# EAGLE design Adafruit STEMMA Piezo Driver Amp (EAGLE 9.6.2)
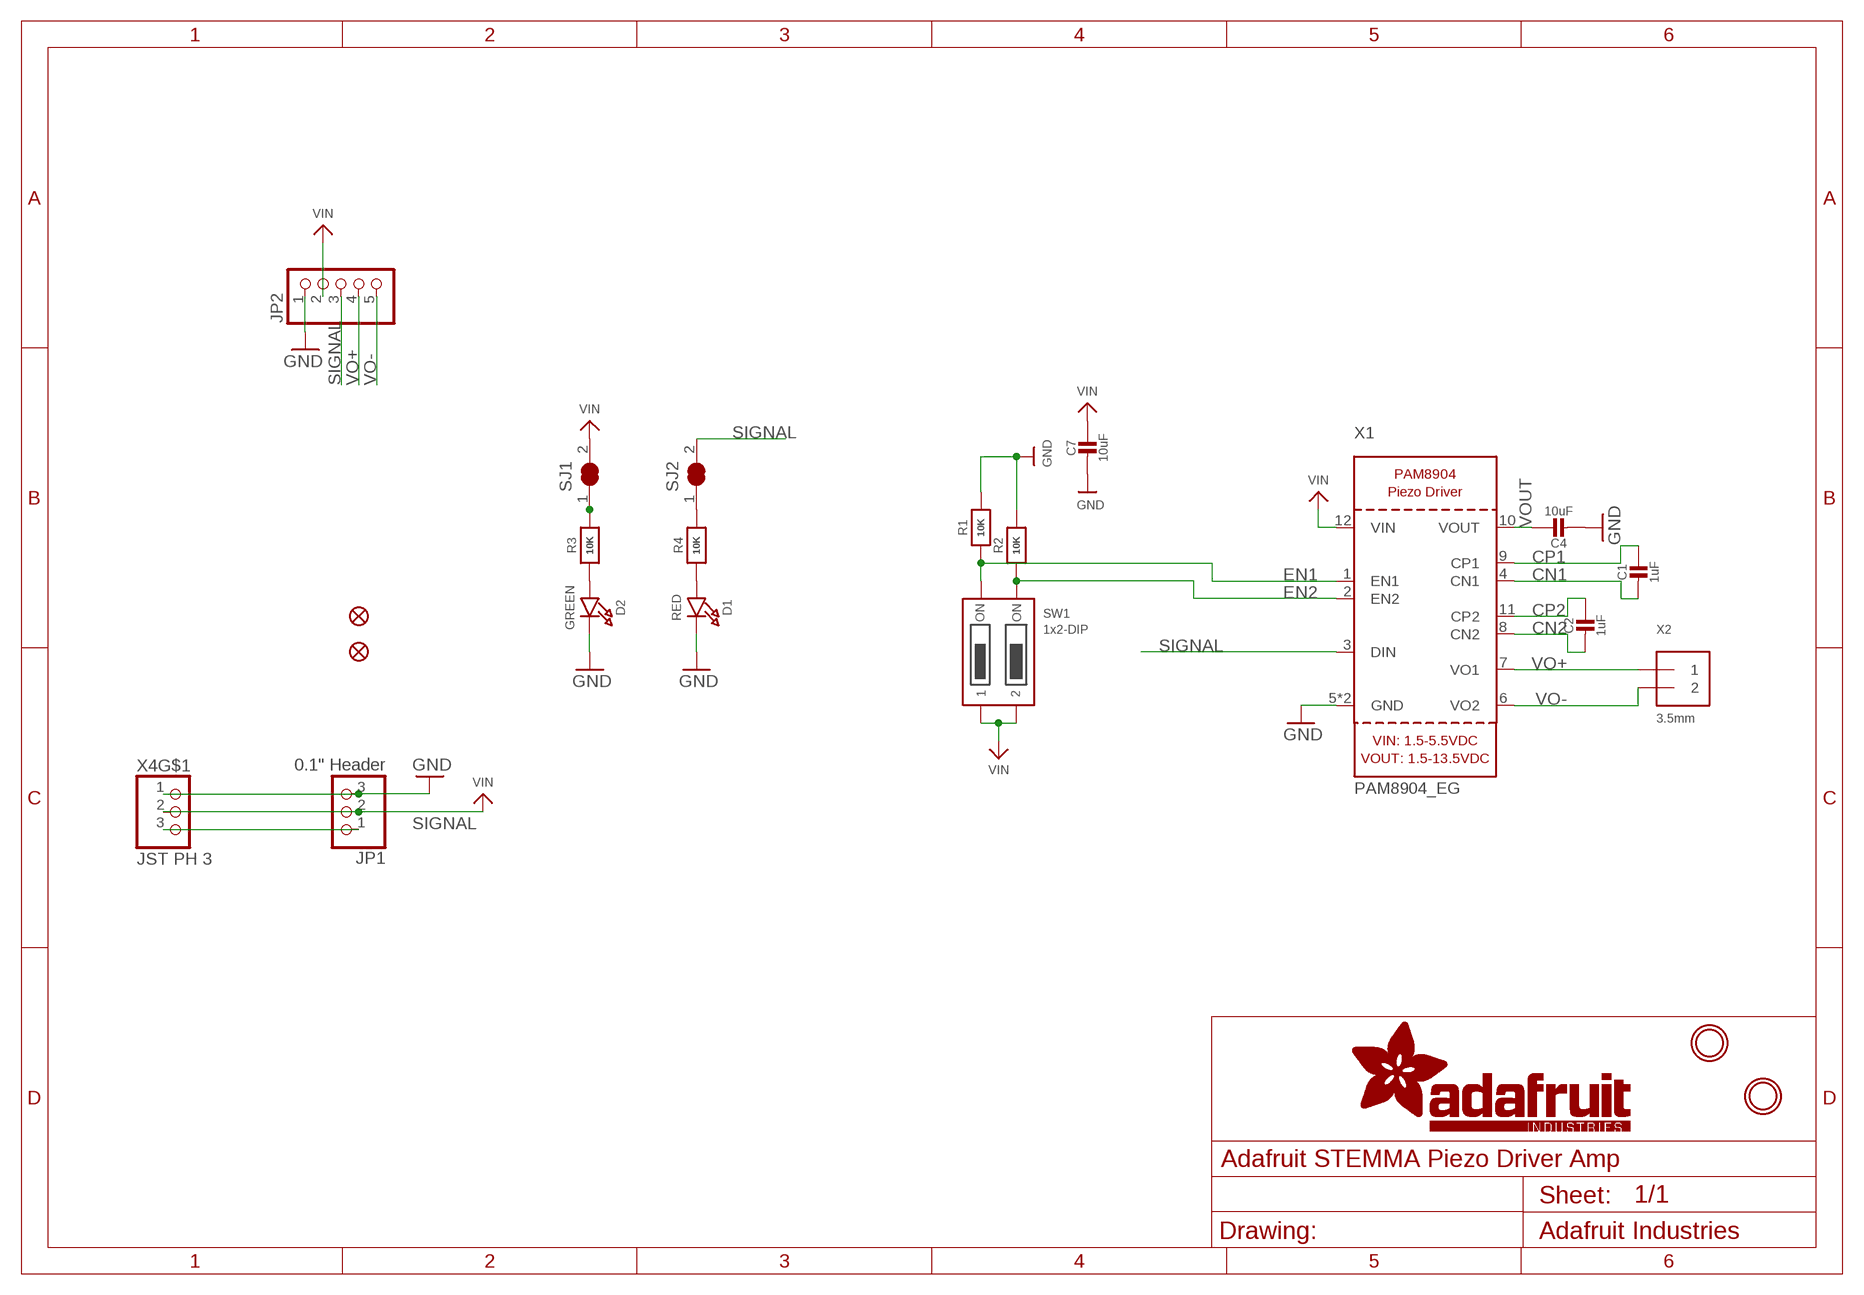
[diagram p0: schematic, sheet 1]

## Parts
C1  1uF  CAP_CERAMIC0603_NO  [0603-NO]
C2  1uF  CAP_CERAMIC0603_NO  [0603-NO]
C4  10uF  CAP_CERAMIC0805-NOOUTLINE  [0805-NO]
C7  10uF  CAP_CERAMIC0805-NOOUTLINE  [0805-NO]
D1  RED  LED0603_NOOUTLINE  [CHIPLED_0603_NOOUTLINE]
D2  GREEN  LED0603_NOOUTLINE  [CHIPLED_0603_NOOUTLINE]
FID2  FIDUCIAL_1MM  [FIDUCIAL_1MM]
FID3  FIDUCIAL_1MM  [FIDUCIAL_1MM]
JP1  0.1" Header  HEADER-1X3  [1X03_OVAL]
JP2  HEADER-1X570MIL  [1X05_ROUND_70]
R1  10K  RESISTOR_0603_NOOUT  [0603-NO]
R2  10K  RESISTOR_0603_NOOUT  [0603-NO]
R3  10K  RESISTOR_0603_NOOUT  [0603-NO]
R4  10K  RESISTOR_0603_NOOUT  [0603-NO]
SJ1  SOLDERJUMPER_CLOSED  [SOLDERJUMPER_CLOSEDWIRE]
SJ2  SOLDERJUMPER_CLOSED  [SOLDERJUMPER_CLOSEDWIRE]
SW1  1x2-DIP  DIPSWITCH_2PIN  [DIPSWITCH_2PIN]
U$1  MOUNTINGHOLE2.5  [MOUNTINGHOLE_2.5_PLATED]
U$8  MOUNTINGHOLE2.5  [MOUNTINGHOLE_2.5_PLATED]
X1  PAM8904_EG  [QFN12-2MM]
X2  3.5mm  TERMBLOCK_1X2_3.5MM  [TERMBLOCK_1X2-3.5MM]
X4  JST PH 3  CON_JST_PH_3PIN  [JSTPH3]

## Nets
CN1: C1.2 X1.4(CN1)
CN2: C2.2 X1.8(CN2)
CP1: C1.1 X1.9(CP1)
CP2: C2.1 X1.11(CP2)
EN1: R1.1 SW1.1ON X1.1(EN1)
EN2: R2.1 SW1.2ON X1.2(EN2)
GND: C4.2 C7.2 D1.C D2.C JP1.3 JP2.1 R1.2 R2.2 X1.5(GND) X1.MT(GND) X4.1
N$1: R3.2 SJ1.1
N$9: D1.A R4.1
N$10: R4.2 SJ2.1
N$26: D2.A R3.1
SIGNAL: JP1.1 JP2.3 SJ2.2 X1.3(DIN) X4.3
VIN: C7.1 JP1.2 JP2.2 SJ1.2 SW1.1OFF SW1.2OFF X1.12(VIN) X4.2
VO+: JP2.4 X1.7(VO1) X2.1
VO-: JP2.5 X1.6(VO2) X2.2
VOUT: C4.1 X1.10(VOUT)
Unconnected: X4.NC1(MT) X4.NC2(MT)

## Library data of the parts
C1 C2 C4 C7 = microbuilder:CAP_CERAMIC: Ceramic Capacitors For new designs, use the packages preceded by an '_' character since they are more reliable: The following footprints should be used on most boards: _0402 - Standard footprint for regular board layouts _0603 - Standard footprint for regular board layouts _0805 - Standard footprint for regular board layouts _1206 - Standard footprint for regular board layouts For extremely tight-pitch boards where space is at a premium, the following 'micro-pitch' footprints can be used (smaller pads, no silkscreen outline, etc.): _0402MP - Micro-pitch footprint for very dense/compact boards _0603MP - Micro-pitch footprint for very dense/compact boards _0805MP - Micro-pitch footprint for very dense/compact boards _1206MP - Micro-pitch footprint for very dense/compact boards
D1 D2 = microbuilder:LED: LED 0603 - 0603 Surface Mount Package 2mA: Green LED - Low Power (3.9mcd, 2ma, 1.7Vf) - Digikey: 475-2709-2-ND Orange LED - Low Power (9.8mcd, 2ma, 1.8Vf) - Digikey: 475-1194-2-ND Red LED - Low Power (5mcd, 2ma, 1.8Vf) - Digikey: 475-1195-2-ND Yellow LED - Low Power (7mcd, 2ma, 1.8Vf) - Digikey: 475-1196-2-ND 5mA: Blue LED - Low Power (17mcd, 5ma, 2.9Vf) - Digikey: LNJ937W8CRACT-ND 0805 - 0805 Surface Mount Package 2mA: Red LED (8.8mcd, 2mA, 1.8Vf, Clear) - Low Power [Digikey: 475-2510-1-ND] Green LED (5mcd, 2mA, 1.8Vf, Clear) - Low Power [Digikey: 475-2730-1-ND] Yellow LED (11.3mcd, 2mA, 1.8Vf, Clear) - Low Power [Digikey: 475-2555-1-ND] 20mA: Red LED (104mcd, 20mA, Diffused) - LS R976 [Digikey: 475-1278-6-ND] Red LED (12mcd, 20mA, 2.0Vf, Clear) - APT2012EC [Digikey: 754-1128-1-ND] Green LED (15mcd, 20mA, 2.2Vf, Clear) - APT2012GC [Digikey: 754-1131-1-ND] Orange LED (160mcd, 20mA, 2.1Vf, Clear) - APT2012SECK [Digikey: 754-1130-1-ND] 1206 - 1206 Surface Mount Package Green LED (26mcd, 20mA, Diffused) - LG N971 [Digikey: 475-1407-6-ND] Red LED (15mcd, 20mA, Diffused) - LH N974 [Digikey: 475-1416-6-ND] Cree - Cree High-Power Surface Mount LEDs XPEBWT-L1-0000-00D50 - White 111lm 350mA 2.9Vf 6200K 110° XTEAWT-00-0000-00000LEE3 - White 114lm 350mA 2.85Vf 5000K 115° Everlight - Everlight 45-21 Series Surface Mount LEDs 45-21/QK2C-B2832AC2CB2/2T - Warm White 2000mcd 20mA 3.25Vf 3050K 120° 45-21/LK2C-B38452C4CB2/2T - Nuetral White 2000mcd 20mA 3.25Vf 4150K 120° 45-21/LK2C-B50634C6CB2/2T - Cold White 2200mcd 20mA 3.25Vf 5650K 120° PLCC2 Reverse Mount LS T77K-J1L2-1-0-2-R18-Z - Red 11.25mcd 2mA 1.8Vf 630nm 120° LO T77K-L1M2-24-Z - Orange 19.6mcd 2mA 1.8Vf 606nm 120° LY T77K-K2M1-26-Z - Yellow 15.7mcd 2mA 1.8Vf 587nm 120°; ROT: 270
FID2 FID3 = microbuilder:FIDUCIAL: Fiducial Alignment Points Various fiducial points for machine vision alignment.; BOM: EXCLUDE
JP1 = microbuilder:HEADER-1X3: PIN HEADER
JP2 = microbuilder:HEADER-1X5: PIN HEADER
R1-R4 = microbuilder:RESISTOR: Resistors For new designs, use the packages preceded by an '_' character since they are more reliable: The following footprints should be used on most boards: _0402 - Standard footprint for regular board layouts _0603 - Standard footprint for regular board layouts _0805 - Standard footprint for regular board layouts _1206 - Standard footprint for regular board layouts For extremely tight-pitch boards where space is at a premium, the following 'micro-pitch' footprints can be used (smaller pads, no silkscreen outline, etc.): _0402MP - Micro-pitch footprint for very dense/compact boards _0603MP - Micro-pitch footprint for very dense/compact boards _0805MP - Micro-pitch footprint for very dense/compact boards _1206MP - Micro-pitch footprint for very dense/compact boards
SJ1 SJ2 = microbuilder:SOLDERJUMPER_CLOSED: Solder Jumper - Closed These solder jumpers are closed by default CLOSEDWIRE - 10 mil trace between pads that can be cut and resoldered later CLOSEDPERM - 63 mil trace between pads for a permanent connection (used to 'bridge' two signals, a shameless hack for Eagle). Can double as a test point as well (no cream layer)
SW1 = adafruit_electromech:DIPSWITCH_2PIN: DIP Switch - 2 Pin - [4UConnector: 19493]
U$1 U$8 = adafruit_electromech:MOUNTINGHOLE: Mounting Hole For #2 screws (0.086"/2.18mm width, 0.094"/2.4mm hole) use 2.5mm; BOM: EXCLUDE
X1 = adafruit_power:PAM8904
X2 = adafruit_electromech:TERMBLOCK_1X2: 3.5mm Terminal block http://www.ladyada.net/library/pcb/eaglelibrary.html; ROT: 180
X4 = adafruit_electromech:CON_JST_PH_3PIN

## Net classes
1 HV: width 0.406 mm, drill 0.381 mm, clearance 0.762 mm

## Board
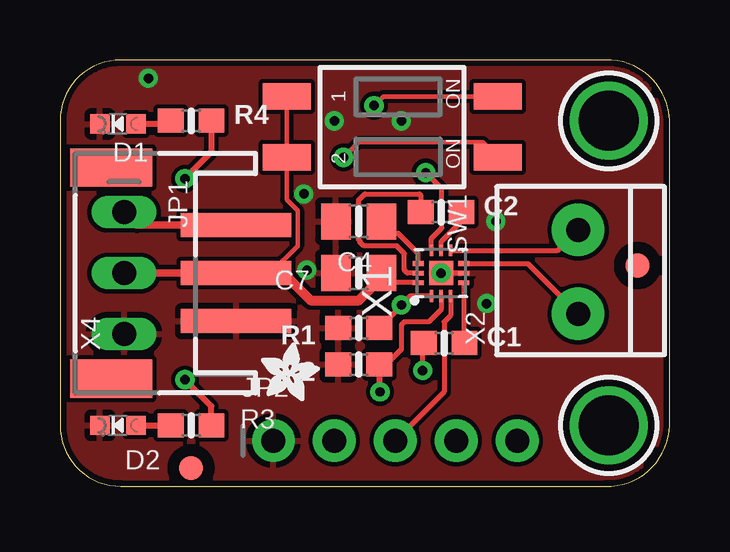
[diagram p1: board, top side]
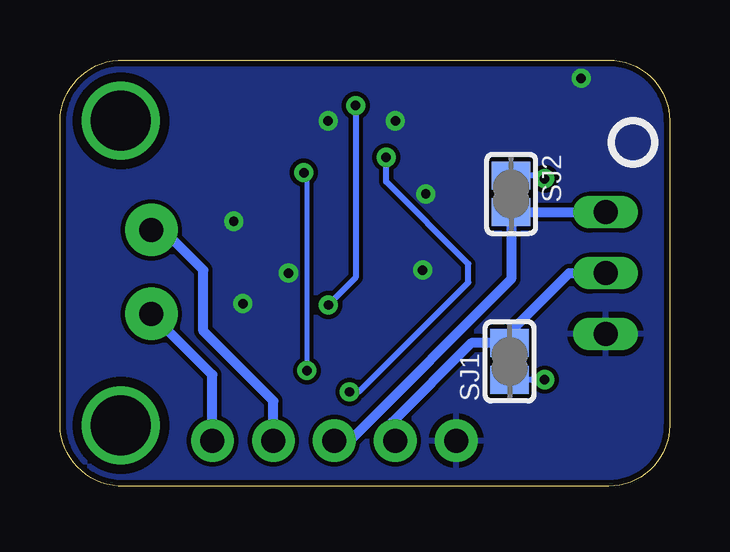
[diagram p2: board, bottom side, seen from below]

Size 25.4 x 17.78 mm. Coordinates in mm from the lower left corner, seen from the top.
Outline: 0,15.24 0,2.54 arc90 2.54,0 22.73,0 arc90 25.4,2.54 25.4,15.24 arc90 22.73,17.78 2.54,17.78 arc90 0,15.24
Copper layers (1*16): Top 0.035mm / dielectric 1.5mm / Bottom 0.035mm
Design rules "adafruit 7-7": minimum track width 7mil, minimum drill 15.5mil, track to track 7mil, track to pad 7mil, pad to pad 7mil, via to via 7mil, smd to smd 7mil, copper to edge 10mil, drill to drill 8mil, minimum pad ring 7mil, minimum via ring 8mil, stop-mask expansion 2mil, vias tented up to drill 20mil, thermal gap 10mil

### Footprints (pad centres in the part's own frame; a part is rotated, then mirrored left to right if it is on the bottom)
0603-NO = smd 1.075 x 1: 1 -0.85,0; 2 0.85,0
0805-NO = smd 1.24 x 1.5: 1 -0.95,0; 2 0.95,0
CHIPLED_0603_NOOUTLINE = smd 0.8 x 0.8: A 0,-0.75; C 0,0.75
FIDUCIAL_1MM = smd 1 x 1: 1 0,0
1X03_OVAL = drill 1 long: 1 -2.54,0; 2 0,0; 3 2.54,0
1X05_ROUND_70 = drill 1 pad 1.778: 1 -5.08,0; 2 -2.54,0; 3 0,0; 4 2.54,0; 5 5.08,0
SOLDERJUMPER_CLOSEDWIRE = smd 1.168 x 1.6: 1 -0.762,0; 2 0.762,0 | smd 0.635 x 0.203: WIRE 0,0
DIPSWITCH_2PIN = smd 1.1 x 2: 1OFF -1.27,-4.4; 1ON -1.27,4.4; 2OFF 1.27,-4.4; 2ON 1.27,4.4
MOUNTINGHOLE_2.5_PLATED = drill 2.5 pad 3.2: P$1 0,0
QFN12-2MM = smd 0.5 x 0.2: 1 -0.95,0.4; 2 -0.95,0; 3 -0.95,-0.4; 7 0.95,-0.4; 8 0.95,0; 9 0.95,0.4 | smd 0.2 x 0.5: 4 -0.4,-0.95; 5 0,-0.95; 6 0.4,-0.95; 10 0.4,0.95; 11 0,0.95; 12 -0.4,0.95 | smd 1 x 1: MT 0,0
TERMBLOCK_1X2-3.5MM = drill 1 pad 2.184: 1 1.8,0; 2 -1.7,0
JSTPH3 = smd 1 x 4.6: 1 -2,-2.7; 2 0,-2.7; 3 2,-2.7 | smd 1.6 x 3.4: NC1 -4.4,2.5; NC2 4.4,2.5

### Placement (x,y rotation side)
C1  16,5.97 0 top
C2  15.88,11.43 0 top
C4  12.45,11.05 180 top
C7  12.45,8.89 180 top
D1  2.41,15.11 90 top
D2  2.41,2.54 90 top
FID2  5.46,0.76 0 top
FID3  24.07,9.21 0 top
JP1  2.67,8.89 270 top
JP2  13.97,1.91 0 top
PLABEL0  [PLABEL0]  1.4,0.76 0 top
PLABEL7  [PLABEL7]  8.89,3.05 90 bottom
PLABEL8  [PLABEL8]  11.43,3.05 90 bottom
PLABEL10  [PLABEL10]  16.51,3.05 90 bottom
PLABEL11  [PLABEL11]  19.05,3.05 90 bottom
PLABEL12  [PLABEL12]  7.75,2.79 0 bottom
PLABEL13  [PLABEL13]  1.27,16 0 top
PLABEL14  [PLABEL14]  20.57,13.08 90 top
PLABEL15  [PLABEL15]  20.57,15.62 90 top
PLABEL16  [PLABEL16]  8.13,14.22 90 top
PLABEL17  [PLABEL17]  14.1,3.68 0 top
PLABEL18  [PLABEL18]  20.19,11.81 0 bottom
PLABEL19  [PLABEL19]  7.75,14.61 0 bottom
PLABEL20  [PLABEL20]  13.97,3.05 90 bottom
R1  12.45,6.6 180 top
R2  12.45,5.08 180 top
R3  5.46,2.54 0 top
R4  5.46,15.24 0 top
SJ1  6.67,5.21 90 bottom
SJ2  6.6,12.19 270 bottom
SW1  13.84,14.99 270 top
U$1  22.86,2.54 0 top
U$5  [PCBFEAT-REV-040]  1.52,14.35 180 bottom
U$8  22.86,15.24 0 top
U$19  [ADAFRUIT_2.5MM]  8.38,3.56 0 top
X1  15.88,8.89 90 top
X2  21.59,8.89 90 top
X4  4.64,8.89 90 top

### Tracks (layer width: path | path; a pad name or v marks a point on that pad's centre or on a via)
CN1
  Top 0.203: X1.4 16.82,6 C1.2
CN2
  Top 0.203: X1.8 15.88,10.2 16.73,11.05 C2.2
CP1  (via drill 0.39)
  Top 0.203: X1.9 15.47,10.34 15.91,10.77 15.91,12.41 v15.24,13.08 | v15.11,4.83 15.11,5.93 C1.1
  Bottom 0.203: v15.24,13.08 15.11,12.95 v15.11,4.83
CP2
  Top 0.203: X1.11 14.48,8.89 14.35,9.02 14.35,9.7 14.03,10.02 12.66,10.02 12.5,10.18 12.5,10.24 12.45,10.29 12.45,11.94 12.7,12.19 14.99,12.19 15.03,12.15 C2.1
EN1  (via drill 0.39)
  Top 0.178: SW1.1ON 13.46,16.26 v13.08,15.88
  Top 0.203: X1.1 14.6,7.94 v14.22,7.56 14.22,7.53 R1.1
  Bottom 0.254: v13.08,15.88 13.08,8.7 v14.22,7.56
EN2  (via drill 0.39)
  Top 0.178: v11.81,13.72 12.45,14.35 17.61,14.35 SW1.2ON
  Top 0.203: X1.2 15.88,7.37 15.37,6.86 14.35,6.86 14.22,6.73 14.22,5.71 13.59,5.08 R2.1
  Top 0.254: R2.1 13.3,3.98 v13.34,3.94
  Bottom 0.254: v13.34,3.94 12.95,3.94 8.38,8.51 8.38,9.27 11.81,12.7 v11.81,13.72
GND  (via drill 0.39)
  Top 0.203: X1.5 X1.MT
  other vias: 15.88,8.89 11.43,15.24 14.22,15.24 10.16,12.19 17.78,7.62 18.16,11.05 3.68,17.02 10.29,9.02
  pour Top: 0,17.78 25.4,17.78 25.4,0 0,0
  pour Bottom: 0,17.78 25.4,17.78 25.4,0 0,0
N$1  (via drill 0.39)
  Top 0.254: R3.2 6.31,3.34 v5.21,4.45
  Bottom 0.254: v5.21,4.45 SJ1.1
N$9
  Top 0.254: R4.1 4.48,15.11 D1.A
N$10  (via drill 0.39)
  Top 0.254: R4.2 6.31,13.93 v5.21,12.83
  Bottom 0.254: v5.21,12.83 5.33,12.95 SJ2.1
N$26
  Top 0.254: D2.A R3.1
SIGNAL
  Top 0.203: X1.3 16.27,7.13 16,6.86 16,3.94 JP2.3
  Top 0.305: X4.3 3.21,10.89 JP1.1
  Bottom 0.406: JP1.1 SJ2.2 6.6,8.64 13.34,1.91 JP2.3
VIN
  Top 0.178: SW1.1OFF SW1.2OFF 9.44,11.96 9.9,11.5 9.9,10.03 8.76,8.89
  Top 0.203: X1.12 13.8,8.49 13.49,8.79 C7.1
  Top 0.305: 9.27,8.89 8.76,8.89 X4.2 JP1.2
  Top 0.406: 9.27,8.89 9.31,8.89 10.44,7.76 12.46,7.76 13.49,8.79
  Bottom 0.406: JP1.2 4.19,8.89 6.67,6.41 SJ1.2 8.26,5.97 11.56,2.67 11.56,2.03 JP2.2
VO+
  Top 0.203: X1.7 20.74,9.84 X2.1
  Bottom 0.406: JP2.4 16.51,3.56 19.43,6.48 19.43,9.02 21.1,10.69 X2.1
VO-
  Top 0.203: X1.6 19.49,9.29 X2.2
  Bottom 0.406: JP2.5 19.05,4.65 X2.2
VOUT
  Top 0.203: X1.10 14.93,9.71 14.1,10.54 13.9,10.54 C4.1

### Text on the board
Pinguin_tBackup: Sig | PAM / 8302 | x2 | ON | Gain | Motor/ / MOSFET / Driver | x1 | Volume | PAM8904 | Sig
Pinguin_bBackup: PAM8302 | Adafruit STEMMA / MOSFET+Diode Driver | SIG | Mono 3W Class D Amp | PAM8904 Piezo Driver / Up to 3x Gain / Differential out / Vin: 2.3V~5.5V / DO NOT USE 3x / MODE w/4V+ | In | On | Vin: 3-5VDC / Max gain 14dB/5x | V+ | 4-8Ω Load | LED, Motor, Solenoid / Out+Vin, Out- Switched / 1.5A Cont. Current / Power:3~30VDC / Logic/PWM:3~20VDC | LED | Sig | GND | GND | Out | GND | V+ | VIN | SIG | SIGNAL | In | VO+ | VO-